# EAGLE design untitled (EAGLE 7.6.0)
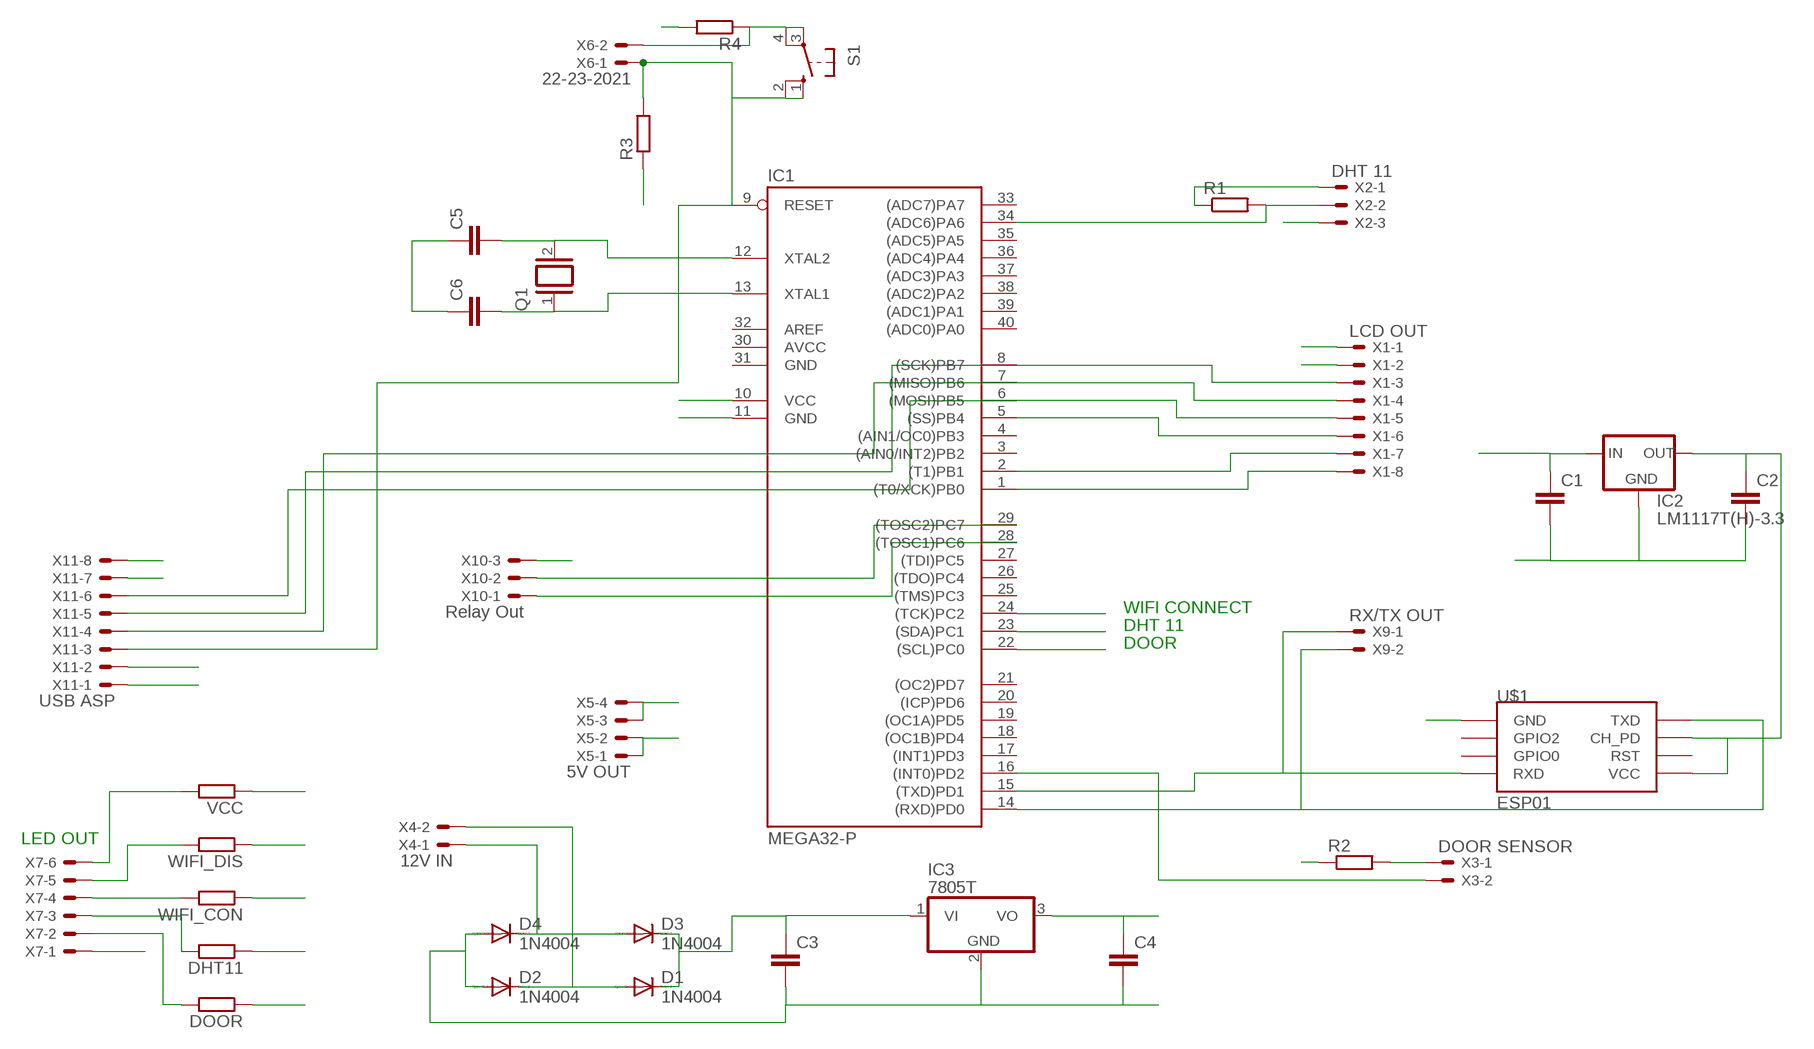
[diagram p0: schematic, sheet 1]

## Parts
C1  C2.5/2  [C2.5-2]
C2  C2.5/2  [C2.5-2]
C3  C5/2.5  [C5B2.5]
C4  C2.5/2  [C2.5-2]
C5  C-EU025-025X050  [C025-025X050]
C6  C-EU025-025X050  [C025-025X050]
D1  1N4004  [DO41-10]
D2  1N4004  [DO41-10]
D3  1N4004  [DO41-10]
D4  1N4004  [DO41-10]
DHT11  R-EU_0204/7  [0204/7]
DOOR  R-EU_0204/7  [0204/7]
IC1  MEGA32-P  [DIL40]
IC2  LM1117T(H)-3.3  [TO220H]
IC3  7805T  [TO220H]
Q1  XTAL/S  [QS]
R1  R-EU_0204/7  [0204/7]
R2  R-EU_0204/7  [0204/7]
R3  R-EU_0204/7  [0204/7]
R4  R-EU_0204/7  [0204/7]
S1  10-XX  [B3F-10XX]
U$1  ESP01  [ESP01]
VCC  R-EU_0204/7  [0204/7]
WIFI_CON  R-EU_0204/7  [0204/7]
WIFI_DIS  R-EU_0204/7  [0204/7]
X1  LCD OUT  22-23-2081  [22-23-2081]
X2  DHT 11  22-23-2031  [22-23-2031]
X3  DOOR SENSOR  22-23-2021  [22-23-2021]
X4  12V IN  22-23-2021  [22-23-2021]
X5  5V OUT  22-23-2041  [22-23-2041]
X6  22-23-2021  [22-23-2021]
X7  22-23-2061  [22-23-2061]
X9  RX/TX OUT  22-23-2021  [22-23-2021]
X10  Relay Out  22-23-2031  [22-23-2031]
X11  USB ASP  22-23-2081  [22-23-2081]

## Nets
12LINE1: D3.A D4.C X4.1
12LINE2: D1.A D2.C X4.2
DHT11: DHT11.1 IC1.23((SDA)PC1)
DOOR: DOOR.1 IC1.22((SCL)PC0)
GND: C1.2 C2.2 C3.2 C4.2 C5.1 C6.1 D2.A D4.A IC1.11(GND) IC2.1(GND) IC3.2(GND) R3.1 U$1.GND X1.2 X2.3 X5.1 X5.2 X7.1 X10.3 X11.7
N$1: IC1.8((SCK)PB7) X1.3 X11.5
N$2: IC1.7((MISO)PB6) X1.4 X11.4
N$3: IC1.6((MOSI)PB5) X1.5 X11.6
N$4: IC1.5((SS)PB4) X1.6
N$5: IC1.2((T1)PB1) X1.7
N$6: IC1.1((T0/XCK)PB0) X1.8
N$7: IC1.34((ADC6)PA6) R1.2 X2.2
N$8: R2.2 X3.1
N$9: IC1.9(RESET) R3.2 S1.1(S) S1.2(S1) X6.1 X11.3
N$10: IC1.16((INT0)PD2) X3.2
N$11: IC1.28((TOSC1)PC6) X10.1
N$12: IC1.29((TOSC2)PC7) X10.2
N$13: C2.1 IC2.2(OUT) U$1.CH_PD U$1.VCC
N$14: C5.2 IC1.12(XTAL2) Q1.2
N$15: C6.2 IC1.13(XTAL1) Q1.1
N$16: C3.1 D1.C D3.C IC3.1(VI)
N$17: VCC.2 X7.6
N$18: WIFI_DIS.2 X7.5
N$19: WIFI_CON.2 X7.4
N$20: DHT11.2 X7.3
N$21: DOOR.2 X7.2
N$23: R4.1 S1.3(P) S1.4(P1) X6.2
RXD: IC1.14((RXD)PD0) U$1.TX(TXD) X9.2 X11.2
TXD: IC1.15((TXD)PD1) U$1.RX(RXD) X9.1 X11.1
VCC: C1.1 C4.1 IC1.10(VCC) IC2.3(IN) IC3.3(VO) R1.1 R2.1 R4.2 VCC.1 WIFI_DIS.1 X1.1 X2.1 X5.3 X5.4 X11.8
WIFI: IC1.24((TCK)PC2) WIFI_CON.1
Unconnected: IC1.3((AIN0/INT2)PB2) IC1.4((AIN1/OC0)PB3) IC1.17((INT1)PD3) IC1.18((OC1B)PD4) IC1.19((OC1A)PD5) IC1.20((ICP)PD6) IC1.21((OC2)PD7) IC1.25((TMS)PC3) IC1.26((TDO)PC4) IC1.27((TDI)PC5) IC1.32(AREF) IC1.33((ADC7)PA7) IC1.35((ADC5)PA5) IC1.36((ADC4)PA4) IC1.37((ADC3)PA3) IC1.38((ADC2)PA2) IC1.39((ADC1)PA1) IC1.40((ADC0)PA0) U$1.GPIO0 U$1.GPIO2 U$1.RST

## Notes on the sheet
- WIFI CONNECT
- DHT 11
- DOOR
- LED OUT

## Power pins joined to a net without a drawn wire
AVCC: IC1.30(AVCC)
GND: IC1.31(GND)

## Library data of the parts
C1-C4 = capacitor-wima:C: CAPACITOR naming: grid - package width
C5 C6 = rcl:C-EU: CAPACITOR, European symbol
D1-D4 = diode:1N4004: DIODE general purpose rectifier, 1 A
DHT11 DOOR R1-R4 VCC WIFI_CON WIFI_DIS = resistor:R-EU_: RESISTOR, European symbol
IC1 = atmel:MEGA32-P: MICROCONTROLLER 32 Kbytes FLASH 2 Kbytes SRAM 1 Kbytes EEPROM USART 8-channel 10 bit ADC Source: www.atmel.com .. doc2503.pdf; MPN: ATMEGA32-16PU; OC_FARNELL: 1661729; OC_NEWARK: 51P1794
IC2 = lm1117_10:LM1117?-*: 800mA Low-Dropout Linear Regulator Source: http://www.ti.com/lit/ds/symlink/lm1117-n.pdf; MF: Texas Instruments; MPN: LM1117T-3.3; OC_FARNELL: 1469056; OC_NEWARK: 13B5347
IC3 = linear:78*: Positive VOLTAGE REGULATOR Source: http://cache.national.com/ds/LM/LM78L05.pdf http://www.fairchildsemi.com/ds/LM/LM7805.pdf
Q1 = special:XTAL/S: CRYSTAL
S1 = switch-omron:10-XX: OMRON SWITCH; MPN: B3F-1000; OC_FARNELL: 176432; OC_NEWARK: 36M3542
U$1 = esp8266modules:ESP01: ESP8266 Wifi module 01
X1 X11 = con-molex:22-23-2081: .100" (2.54mm) Center Header - 8 Pin; MF: MOLEX; MPN: 22-23-2081; OC_FARNELL: 1756826; OC_NEWARK: 01C7592
X2 X10 = con-molex:22-23-2031: .100" (2.54mm) Center Header - 3 Pin; MF: MOLEX; MPN: 22-23-2031; OC_FARNELL: 1462950; OC_NEWARK: 30C0862
X3 X4 X6 X9 = con-molex:22-23-2021: .100" (2.54mm) Center Header - 2 Pin; MF: MOLEX; MPN: 22-23-2021; OC_FARNELL: 1462926; OC_NEWARK: 25C3832
X5 = con-molex:22-23-2041: .100" (2.54mm) Center Header - 4 Pin; MF: MOLEX; MPN: 22-23-2041; OC_FARNELL: 1462920; OC_NEWARK: 38C0355
X7 = con-molex:22-23-2061: .100" (2.54mm) Center Header - 6 Pin; MF: MOLEX; MPN: 22-23-2061; OC_FARNELL: 1462922; OC_NEWARK: 27C1933

## Net classes
0 default: width 1.016 mm, drill 1.016 mm, clearance 1.016 mm

## Board
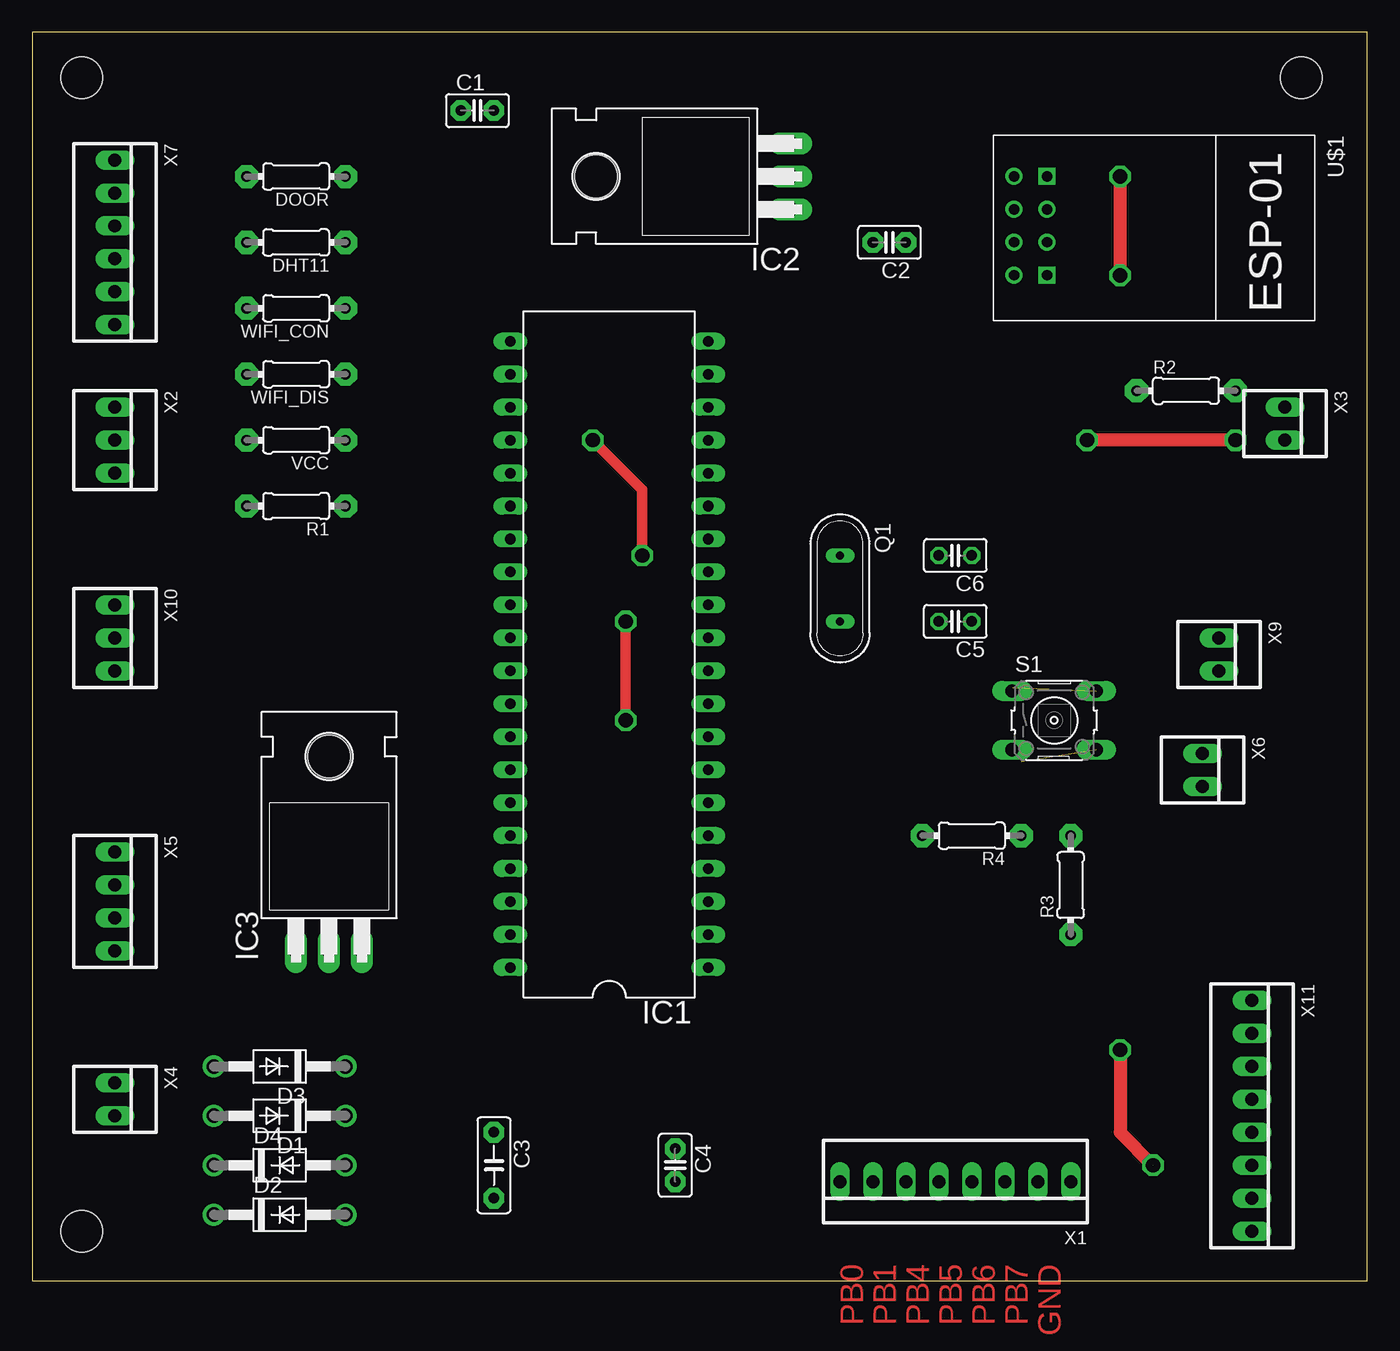
[diagram p1: board, top side]
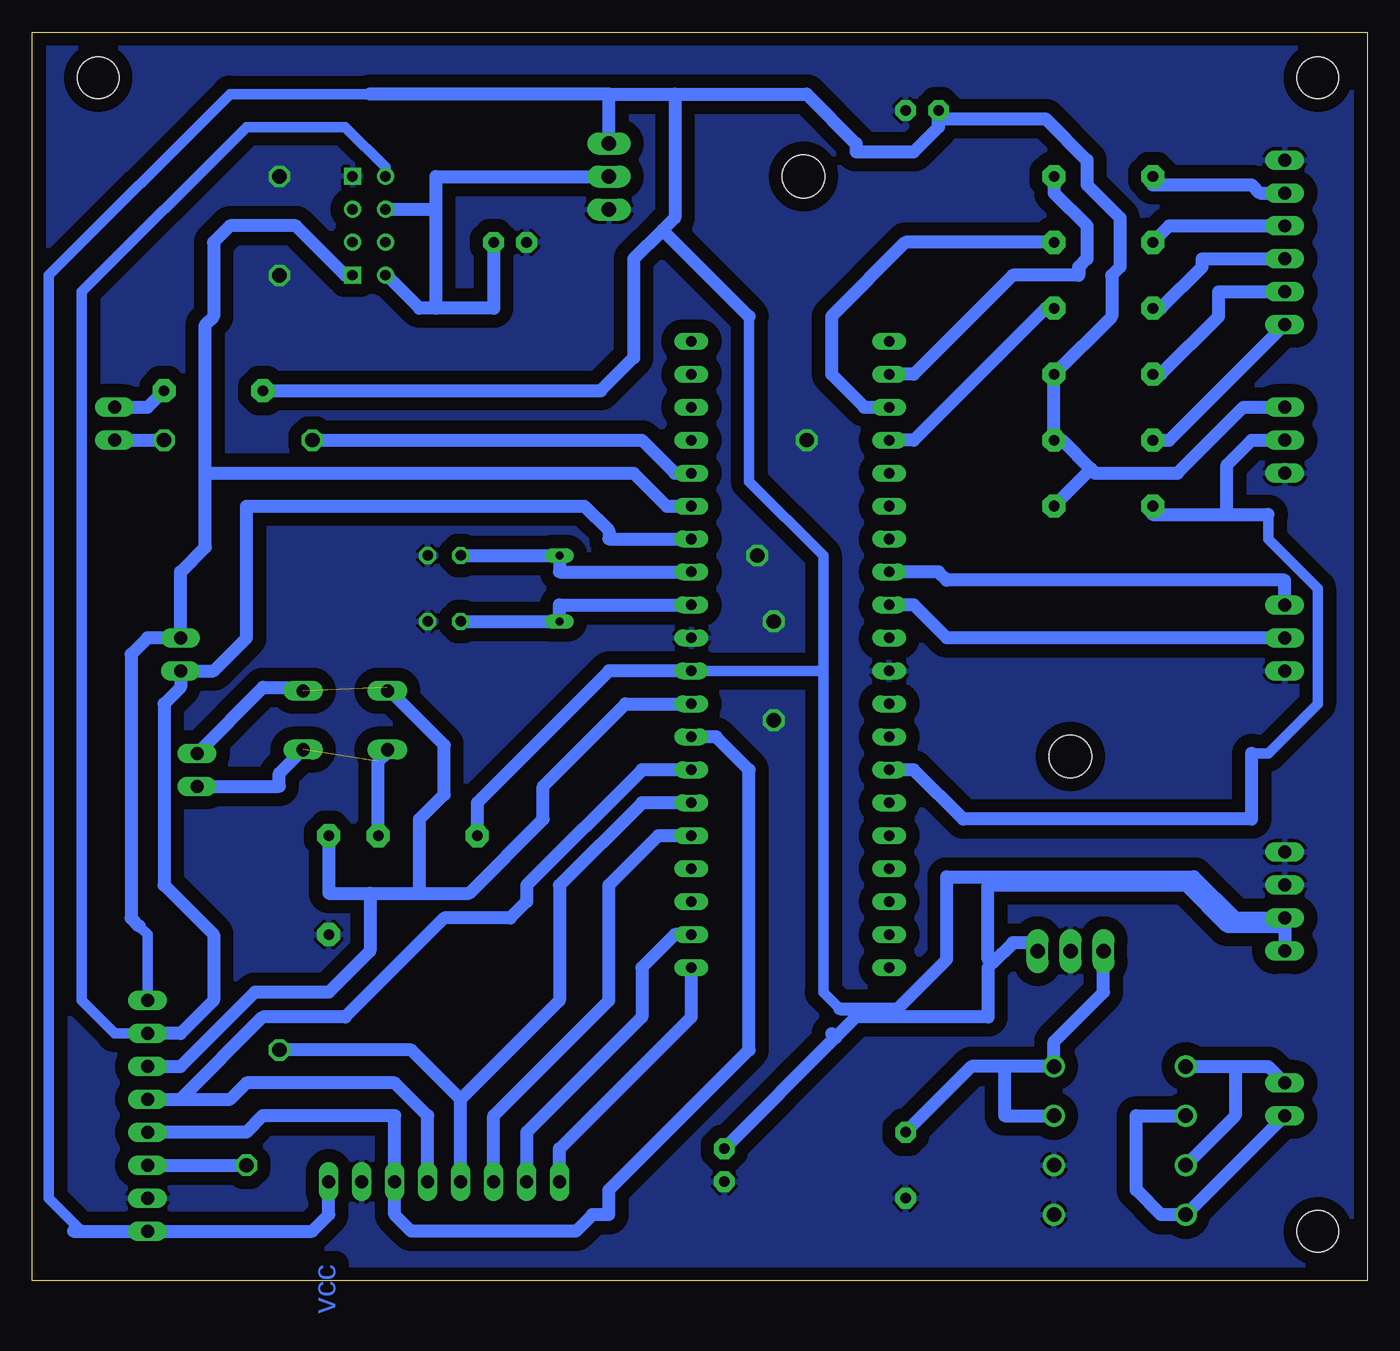
[diagram p2: board, bottom side, seen from below]

Size 102.85 x 96.19 mm. Coordinates in mm from the lower left corner, seen from the top.
Outline: 0,0 102.85,0 102.85,96.19 0,96.19 0,0
Copper layers (1*16): Top 0.035mm / dielectric 1.5mm / Bottom 0.035mm
Design rules "default": minimum track width 10mil, minimum drill 24mil, track to track 8mil, track to pad 8mil, pad to pad 8mil, via to via 8mil, smd to smd 8mil, copper to edge 40mil, drill to drill 8mil, minimum pad ring 10mil, minimum via ring 8mil, stop-mask expansion 4mil, vias tented up to drill 0mil, thermal gap 10mil
Holes 3.2 mm at 97.79,92.71 3.81,92.71 3.81,3.81

### Footprints (pad centres in the part's own frame; a part is rotated, then mirrored left to right if it is on the bottom)
C2.5-2 = drill 0.813 pad 1.6 octagon: 1 -1.27,0; 2 1.27,0
C5B2.5 = drill 0.813 pad 1.6 octagon: 1 -2.54,0; 2 2.54,0
C025-025X050 = drill 0.813 octagon: 1 -1.27,0; 2 1.27,0
DO41-10 = drill 1.118: A 5.08,0; C -5.08,0
0204/7 = drill 0.813 pad 1.778 octagon: 1 -3.81,0; 2 3.81,0
DIL40 = drill 0.813 long: 1 -24.13,-7.62; 2 -21.59,-7.62; 3 -19.05,-7.62; 4 -16.51,-7.62; 5 -13.97,-7.62; 6 -11.43,-7.62; 7 -8.89,-7.62; 8 -6.35,-7.62; 9 -3.81,-7.62; 10 -1.27,-7.62; 11 1.27,-7.62; 12 3.81,-7.62; 13 6.35,-7.62; 14 8.89,-7.62; 15 11.43,-7.62; 16 13.97,-7.62; 17 16.51,-7.62; 18 19.05,-7.62; 19 21.59,-7.62; 20 24.13,-7.62; 21 24.13,7.62; 22 21.59,7.62; 23 19.05,7.62; 24 16.51,7.62; 25 13.97,7.62; 26 11.43,7.62; 27 8.89,7.62; 28 6.35,7.62; 29 3.81,7.62; 30 1.27,7.62; 31 -1.27,7.62; 32 -3.81,7.62; 33 -6.35,7.62; 34 -8.89,7.62; 35 -11.43,7.62; 36 -13.97,7.62; 37 -16.51,7.62; 38 -19.05,7.62; 39 -21.59,7.62; 40 -24.13,7.62
TO220H = drill 1.118 long: 1 -2.54,-10.16; 2 0,-10.16; 3 2.54,-10.16 | hole 3.302: 0,4.826
QS = drill 0.61 long: 1 -2.54,0; 2 2.54,0
B3F-10XX = drill 1.016 long: 1 -3.251,2.261; 2 3.251,2.261; 3 -3.251,-2.261; 4 3.251,-2.261
ESP01 = drill 0.8: CH_PD -1.285,-8.178; GPIO0 1.255,-5.638; GPIO2 -1.285,-5.638; RST 1.255,-8.178; TX -3.825,-8.178; VCC 3.795,-8.178 | drill 0.8 square: GND -3.825,-5.638; RX 3.795,-5.638
22-23-2081 = drill 1 long: 1 -8.89,0; 2 -6.35,0; 3 -3.81,0; 4 -1.27,0; 5 1.27,0; 6 3.81,0; 7 6.35,0; 8 8.89,0
22-23-2031 = drill 1 long: 1 -2.54,0; 2 0,0; 3 2.54,0
22-23-2021 = drill 1 long: 1 -1.27,0; 2 1.27,0
22-23-2041 = drill 1 long: 1 -3.81,0; 2 -1.27,0; 3 1.27,0; 4 3.81,0
22-23-2061 = drill 1 long: 1 -6.35,0; 2 -3.81,0; 3 -1.27,0; 4 1.27,0; 5 3.81,0; 6 6.35,0

### Placement (x,y rotation side)
C1  34.29,90.17 0 top
C2  66.04,80.01 180 top
C3  35.56,8.89 270 top
C4  49.53,8.89 270 top
C5  71.12,50.8 180 top
C6  71.12,55.88 180 top
D1  19.05,12.7 180 top
D2  19.05,5.08 0 top
D3  19.05,16.51 180 top
D4  19.05,8.89 0 top
DHT11  20.32,80.01 180 top
DOOR  20.32,85.09 180 top
IC1  44.45,48.26 90 top
IC2  48.26,85.09 90 top
IC3  22.86,35.56 0 top
Q1  62.23,53.34 270 top
R1  20.32,59.69 180 top
R2  88.9,68.58 0 top
R3  80.01,30.48 90 top
R4  72.39,34.29 180 top
S1  78.74,43.18 0 top
U$1  83.82,81.28 270 top
VCC  20.32,64.77 180 top
WIFI_CON  20.32,74.93 180 top
WIFI_DIS  20.32,69.85 180 top
X1  71.12,7.62 180 top
X2  6.35,64.77 270 top
X3  96.52,66.04 270 top
X4  6.35,13.97 270 top
X5  6.35,29.21 270 top
X6  90.17,39.37 270 top
X7  6.35,80.01 270 top
X9  91.44,48.26 270 top
X10  6.35,49.53 270 top
X11  93.98,12.7 270 top

### Tracks (layer width: path | path; a pad name or v marks a point on that pad's centre or on a via)
12LINE1
  Bottom 1.016: X4.1 7.62,16.51 10.16,16.51 | D3.A 10.16,16.51 | D4.C 10.16,12.7 10.16,16.51
12LINE2
  Bottom 1.016: X4.2 D2.C 15.88,5.08 17.78,6.99 17.78,12.7 D1.A
DHT11
  Bottom 1.016: IC1.23 38.73,67.31 41.27,69.85 41.27,74.3 35.56,80.01 DHT11.1
DOOR
  Bottom 1.016: IC1.22 34.92,69.85 27.3,77.47 22.22,77.47 22.22,78.11 21.59,78.74 21.59,81.28 24.13,83.82 DOOR.1
GND  (via drill 1.1 pad 0.3, 1.1 pad 0.61)
  Top 0.813: v46.99,55.88 46.99,60.96 v43.18,64.77 | v45.72,43.18 v45.72,50.8
  Top 1.016: v83.82,77.47 v83.82,85.09
  pour Bottom: 0,96.52 101.6,96.52 101.6,0 0,0
N$1
  Bottom 1.016: IC1.8 50.16,41.91 47.62,39.37 47.62,17.78 58.42,6.99 58.42,5.08 59.69,5.08 60.96,3.81 73.66,3.81 74.93,5.08 X1.3 74.93,12.7 85.09,12.7 86.36,11.43 X11.5
N$2
  Bottom 1.016: IC1.7 55.88,39.37 64.77,30.48 64.77,29.21 66.04,27.94 71.12,27.94 78.74,20.32 85.09,20.32 91.44,13.97 | X11.4 91.44,13.97 | 91.44,13.97 87.63,13.97 86.36,15.24 74.93,15.24 72.39,12.7 X1.4
N$3  (via drill 1.1 pad 0.61)  (1 unrouted)
  Top 1.016: v83.82,17.78 83.82,11.43 86.36,8.89
  Bottom 1.016: IC1.6 55.88,36.83 62.23,30.48 62.23,21.59 69.85,13.97 | X11.6 86.36,8.89 | X1.5 69.85,13.97 | 69.85,13.97 73.66,17.78 v83.82,17.78
N$4
  Bottom 1.016: X1.6 67.31,12.7 58.42,21.59 58.42,30.48 54.61,34.29 IC1.5
N$5
  Bottom 1.016: IC1.2 53.34,26.67 55.88,24.13 55.88,20.32 64.77,11.43 X1.7
N$6
  Bottom 1.016: X1.8 62.23,10.16 52.07,20.32 IC1.1
N$7
  Bottom 0.813: 7.62,59.05 7.62,57.15 3.81,53.34 3.81,44.45 7.62,40.64 8.89,40.64
  Bottom 1.016: IC1.34 34.92,39.37 31.11,35.56 8.89,35.56 8.89,40.64 | 10.8,59.05 16.51,59.05 R1.2 | 10.8,59.05 7.62,59.05 | X2.2 8.89,64.77 10.8,62.87 10.8,59.05
N$8
  Bottom 1.016: X3.1 93.98,67.31 R2.2
N$9  (1 unrouted)
  Bottom 1.016: 75.57,45.72 S1.1 74.93,45.09 71.12,41.27 71.12,37.47 73.02,35.56 73.02,29.84 | IC1.9 57.15,44.45 63.5,38.1 63.5,35.56 69.22,29.84 73.02,29.84 | 76.83,29.84 80.01,29.84 R3.2 | 76.83,29.84 73.02,29.84 | 76.83,29.84 76.83,25.4 80.01,22.23 85.73,22.23 91.44,16.51 X11.3 | X6.1 85.09,45.72 82.27,45.72 S1.2
N$10  (via drill 1.1 pad 0.61)
  Top 1.016: v92.71,64.77 v81.28,64.77
  Bottom 1.016: X3.2 v92.71,64.77 | v81.28,64.77 55.88,64.77 53.34,62.23 IC1.16
N$11
  Bottom 1.016: IC1.28 33.02,54.61 32.39,53.98 6.35,53.98 X10.1
N$12
  Bottom 1.016: IC1.29 34.92,52.07 32.39,49.53 X10.2
N$13
  Bottom 1.016: 71.76,74.93 67.31,74.93 C2.1 | 71.76,74.93 73.02,74.93 75.57,77.47 U$1.VCC | 71.76,82.55 75.57,82.55 U$1.CH_PD | 71.76,74.93 71.76,82.55 | IC2.2 71.76,85.09 71.76,82.55
N$14
  Bottom 1.016: C5.2 Q1.2 62.23,52.07 IC1.12
N$15
  Bottom 1.016: C6.2 Q1.1 62.23,54.61 IC1.13
N$16
  Bottom 1.016: C3.1 30.48,16.51 27.94,16.51 | 27.94,16.51 D3.C 24.13,18.41 20.32,22.23 IC3.1 | D1.C 27.94,12.7 27.94,16.51
N$17
  Bottom 1.016: X7.6 15.24,64.77 VCC.2
N$18
  Bottom 1.016: X7.5 11.43,76.2 11.43,74.3 15.88,69.85 WIFI_DIS.2
N$19
  Bottom 1.016: X7.4 12.7,78.74 12.7,78.11 15.88,74.93 WIFI_CON.2
N$20
  Bottom 1.016: X7.3 15.24,81.28 DHT11.2
N$21
  Bottom 1.016: X7.2 8.25,83.82 8.89,84.45 16.51,84.45 DOOR.2
N$22  (via drill 1.1 pad 0.61)
  other vias: 83.82,17.78
N$23  (1 unrouted)
  Bottom 1.016: R4.1 76.2,40.01 75.57,40.64 S1.3 | X6.2 83.82,38.1 83.82,39.09 S1.4
N$24  (via drill 1.1 pad 0.61)
  other vias: 86.36,8.89
N$25  (via drill 1.1 pad 0.61)
  other vias: 92.71,64.77
N$26  (via drill 1.1 pad 0.61)
  other vias: 81.28,64.77
RXD
  Bottom 0.813: U$1.TX 75.64,85.8 78.74,88.9 86.36,88.9 99.06,76.2 99.06,21.59 96.52,19.05 X11.2
  Bottom 1.016: IC1.14 58.42,57.15 58.42,57.78 60.33,59.69 86.36,59.69 86.36,49.53 88.9,46.99 X9.2 91.44,45.72 92.71,44.45 92.71,30.48 88.9,26.67 88.9,21.59 91.44,19.05 X11.2
TXD
  Bottom 0.813: 94.61,27.3 93.98,26.67 X11.1
  Bottom 1.016: 89.54,62.23 89.54,56.52 91.44,54.61 X9.1 93.98,49.53 95.25,48.26 95.25,27.94 94.61,27.3 | 89.54,62.23 89.54,73.66 88.9,74.3 88.9,80.01 87.63,81.28 82.55,81.28 78.74,77.47 U$1.RX | IC1.15 53.97,59.69 56.52,62.23 89.54,62.23
VCC
  Bottom 0.813: 76.83,91.44 87.63,91.44 101.6,77.47 101.6,6.35 99.06,3.81 | 47.62,74.3 47.62,61.59 41.91,55.88 41.91,46.99 | 41.91,46.99 41.91,22.23 40.64,20.95 | IC1.10 41.91,46.99
  Bottom 1.016: 6.35,27.3 X5.4 | 40.96,18.73 39.37,20.32 29.21,20.32 29.21,24.13 28.89,24.45 | 40.96,18.73 C4.1 | 28.89,24.45 27.3,26.04 25.4,26.04 IC3.3 | 6.35,27.3 10.8,27.3 13.97,30.48 29.21,30.48 29.21,24.77 28.89,24.45 | 6.35,27.3 X5.3 10.16,27.94 13.33,31.11 32.39,31.11 32.39,24.77 36.19,20.95 40.64,20.95 | 41.27,19.05 40.96,18.73 | X2.1 9.52,67.31 14.61,62.23 20.95,62.23 21.27,62.55 | 21.27,62.55 23.5,64.77 VCC.1 WIFI_DIS.1 19.69,74.3 19.69,77.47 19.05,78.11 19.05,81.92 21.59,84.45 21.59,86.36 24.77,89.53 33.02,89.53 | 21.27,62.55 R1.1 | 33.02,89.53 33.02,88.9 34.92,87 39.37,87 39.37,87.63 43.18,91.44 53.34,91.44 | 58.42,91.44 53.34,91.44 | IC2.3 58.42,91.44 | 54.29,80.96 53.34,81.92 53.34,91.44 | 54.29,80.96 56.52,78.74 56.52,71.12 59.05,68.58 R2.1 | 99.7,3.81 99.06,3.81 X11.8 81.28,3.81 80.01,5.08 X1.1 | 58.42,91.44 76.83,91.44 | 33.02,89.53 C1.1 | 54.29,80.96 47.62,74.3 | IC1.10 58.42,46.99 68.58,36.83 R4.2
WIFI
  Bottom 1.016: IC1.24 34.92,64.77 24.77,74.93 WIFI_CON.1

### Text on the board
Top: PB0 | PB1 | PB4 | PB5 | PB6 | PB7 | GND
Bottom: vcc